# EAGLE schematic sap_flux-v20 (EAGLE 8.0.0)

## Sheet 1 of 3
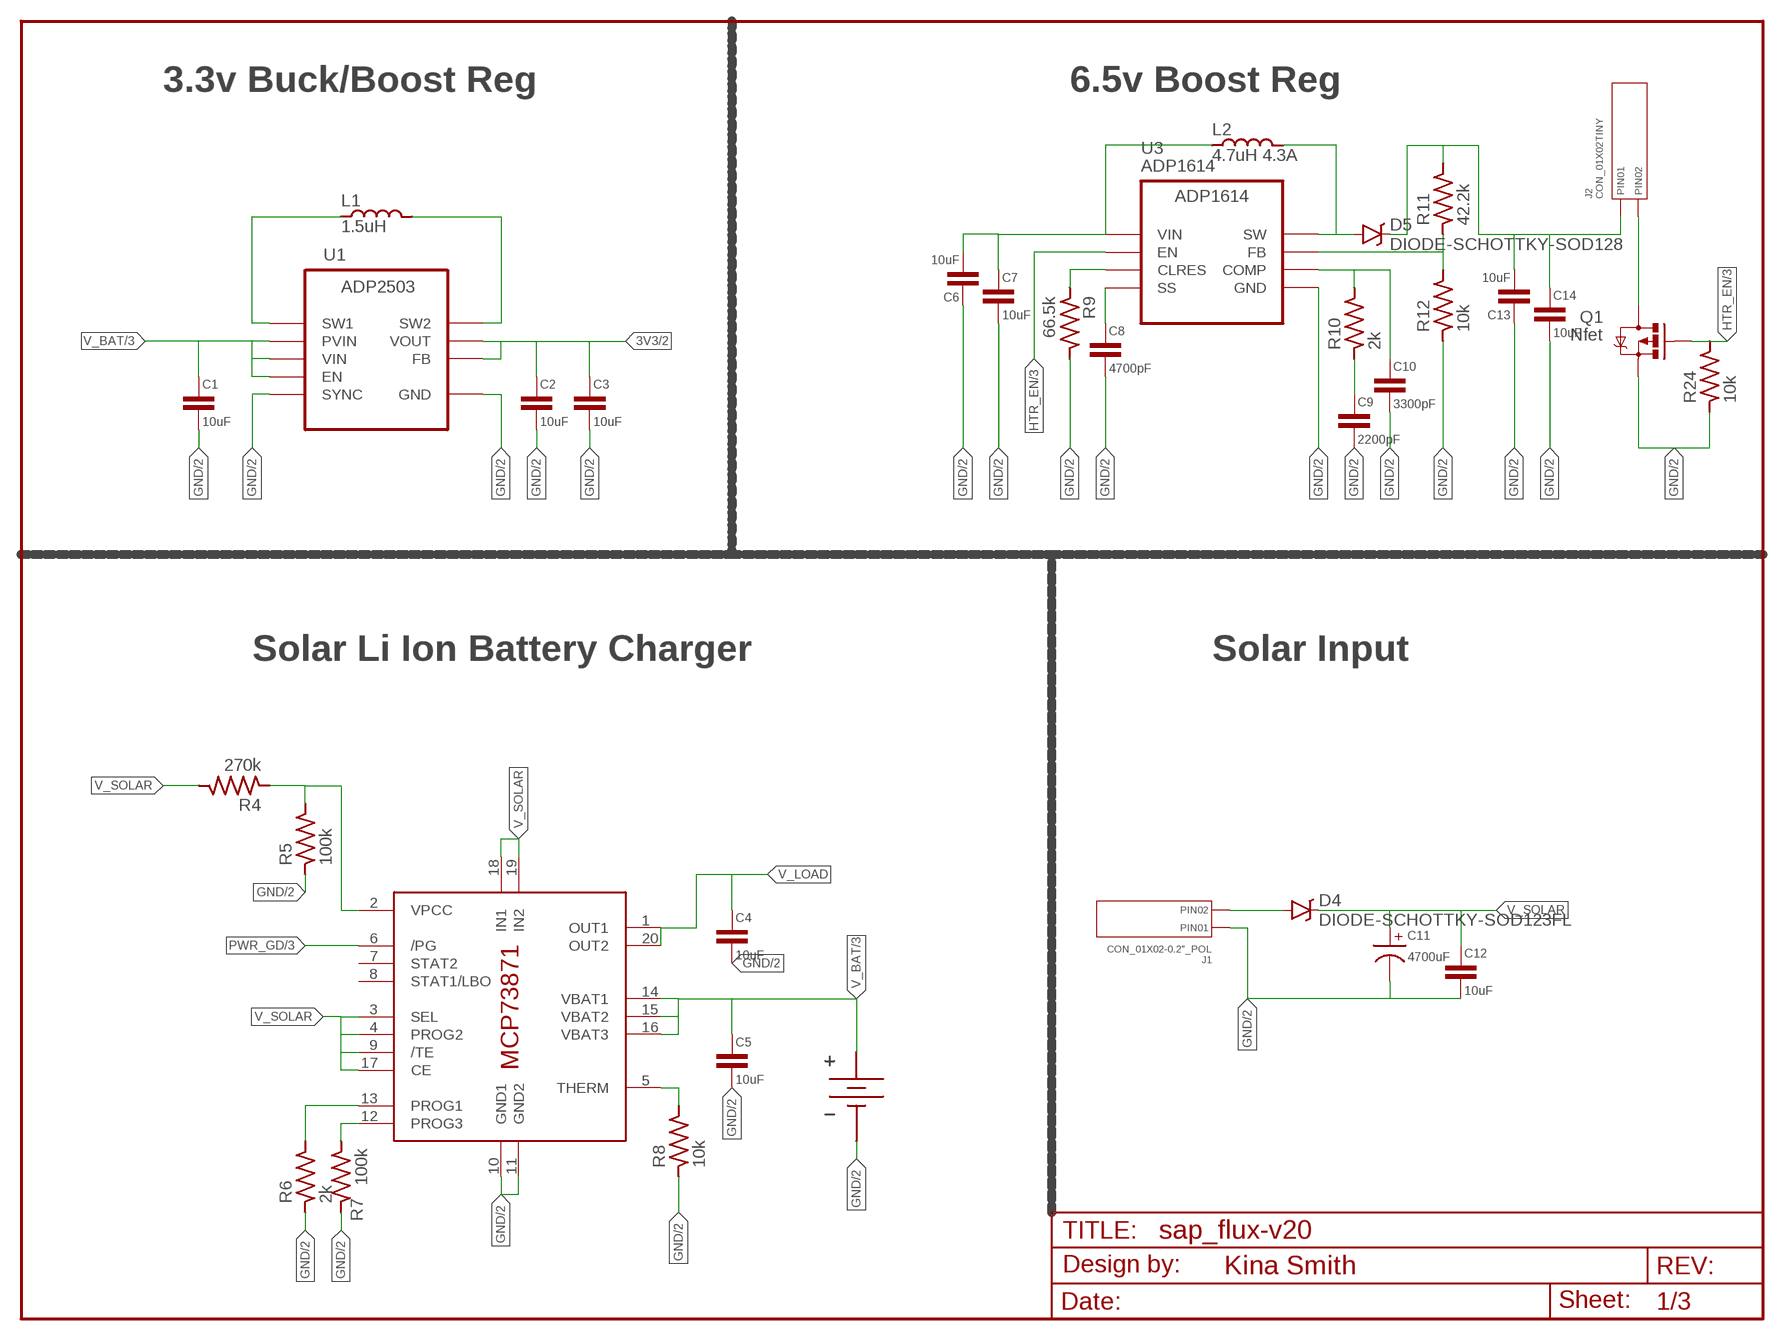
[diagram p0: schematic, sheet 1]

### Parts
BATT1  BATTERY_HOLDER-18650_CLIP  [BAT_18650_CLIP]
C1  10uF  CAPACITOR_NP0805-N  [C0805-N]
C2  10uF  CAPACITOR_NP0805-N  [C0805-N]
C3  10uF  CAPACITOR_NP0805-N  [C0805-N]
C4  10uF  CAPACITOR_NP0805-N  [C0805-N]
C5  10uF  CAPACITOR_NP0805-N  [C0805-N]
C6  10uF  CAPACITOR_NP0805-N  [C0805-N]
C7  10uF  CAPACITOR_NP0805-N  [C0805-N]
C8  4700pF  CAPACITOR_NP0603-N  [C0603-N]
C9  2200pF  CAPACITOR_NP0603-N  [C0603-N]
C10  3300pF  CAPACITOR_NP0603-N  [C0603-N]
C11  4700uF  CAPACITOR_P-TH_5MM  [CP_TH_5MM]
C12  10uF  CAPACITOR_NP0805-N  [C0805-N]
C13  10uF  CAPACITOR_NP0805-N  [C0805-N]
C14  10uF  CAPACITOR_NP0805-N  [C0805-N]
D4  DIODE-SCHOTTKY-SOD123FL  [SOD-123FL]
D5  DIODE-SCHOTTKY-SOD128  [SOD128]
FRAME1  FRAME-LETTER  [CREATIVE_COMMONS]
J1  CON_01X02-0.2"_POL  [1X02_SCREWTERM_0.2IN]
J2  CON_01X02TINY  [1X02_TINY]
L1  1.5uH  INDUCTOR3030  [L3030]
L2  4.7uH 4.3A  INDUCTOR8080  [L8080]
Q1  Nfet  MOSFET-PCHANNELSOT23-3  [SOT23-3]
R4  270k  RESISTOR0603-N  [R0603-N]
R5  100k  RESISTOR0603-N  [R0603-N]
R6  2k  RESISTOR0603-N  [R0603-N]
R7  100k  RESISTOR0603-N  [R0603-N]
R8  10k  RESISTOR0603-N  [R0603-N]
R9  66.5k  RESISTOR0603-N  [R0603-N]
R10  2k  RESISTOR0603-N  [R0603-N]
R11  42.2k  RESISTOR0603-N  [R0603-N]
R12  10k  RESISTOR0603-N  [R0603-N]
R24  10k  RESISTOR0603-N  [R0603-N]
U1  ADP2503  [DFN300X300X80-11N]
U2  MCP73871  [QFN20]
U3  ADP1614  [DFN300X300X80-11N]

### Nets
3V3: C2.1 C3.1 U1.1(VOUT) U1.10(FB) ; also sheet 2,3
6V5: C13.2 C14.1 D5.C-1(C) J2.NEG(PIN1) R11.2
6V5_INDUCTOR: D5.A-2(A) L2.2 U3.6(SW) U3.7(SW)
GND: BATT1.NEG_1(GND) BATT1.NEG_2(GND) BATT1.NEG_3(GND) C1.2 C2.2 C3.2 C4.2 C5.2 C6.1 C7.2 C8.2 C9.2 C10.2 C11.NEG C12.2 C13.1 C14.2 J1.NEG(PIN1) Q1.2(S) R5.1 R6.1 R7.1 R8.1 R9.2 R12.1 R24.1 U1.3(GND) U1.7(SYNC) U1.9(GND) U1.11(GND) U2.10(GND1) U2.11(GND2) U3.4(GND) U3.5(GND) U3.11(GND) ; also sheet 2,3
HTR_EN: Q1.1(G) R24.2 U3.3(EN) ; also sheet 3
N$5: D4.A J1.POS(PIN2)
N$7: R4.1 R5.2 U2.2(VPCC)
N$12: R6.2 U2.13(PROG1)
N$13: R7.2 U2.12(PROG3)
N$17: L1.P$1 U1.4(SW1)
N$18: L1.P$2 U1.2(SW2)
N$19: R8.2 U2.5(THERM)
N$20: J2.POS(PIN2) Q1.3(D)
N$21: C8.1 U3.10(SS)
N$22: R9.1 U3.9(CLRES)
N$26: R11.1 R12.2 U3.2(FB)
N$28: C10.1 R10.2 U3.1(COMP)
N$29: C9.1 R10.1
PWR_GD: U2.6(/PG) ; also sheet 3
V_BAT: BATT1.POS_1(VBAT) BATT1.POS_2(VBAT) BATT1.POS_3(VBAT) C1.1 C5.1 C6.2 C7.1 L2.1 U1.5(PVIN) U1.6(EN) U1.8(VIN) U2.14(VBAT1) U2.15(VBAT2) U2.16(VBAT3) U3.8(VIN) ; also sheet 3
V_LOAD: C4.1 U2.1(OUT1) U2.20(OUT2)
V_SOLAR: C11.POS C12.1 D4.C R4.2 U2.3(SEL) U2.4(PROG2) U2.9(/TE) U2.17(CE) U2.18(IN1) U2.19(IN2)
Unconnected: U2.7(STAT2) U2.8(STAT1/LBO)

### Notes on the sheet
- 3.3v Buck/Boost Reg | 6.5v Boost Reg
- Solar Li Ion Battery Charger | Solar Input

## Sheet 2 of 3
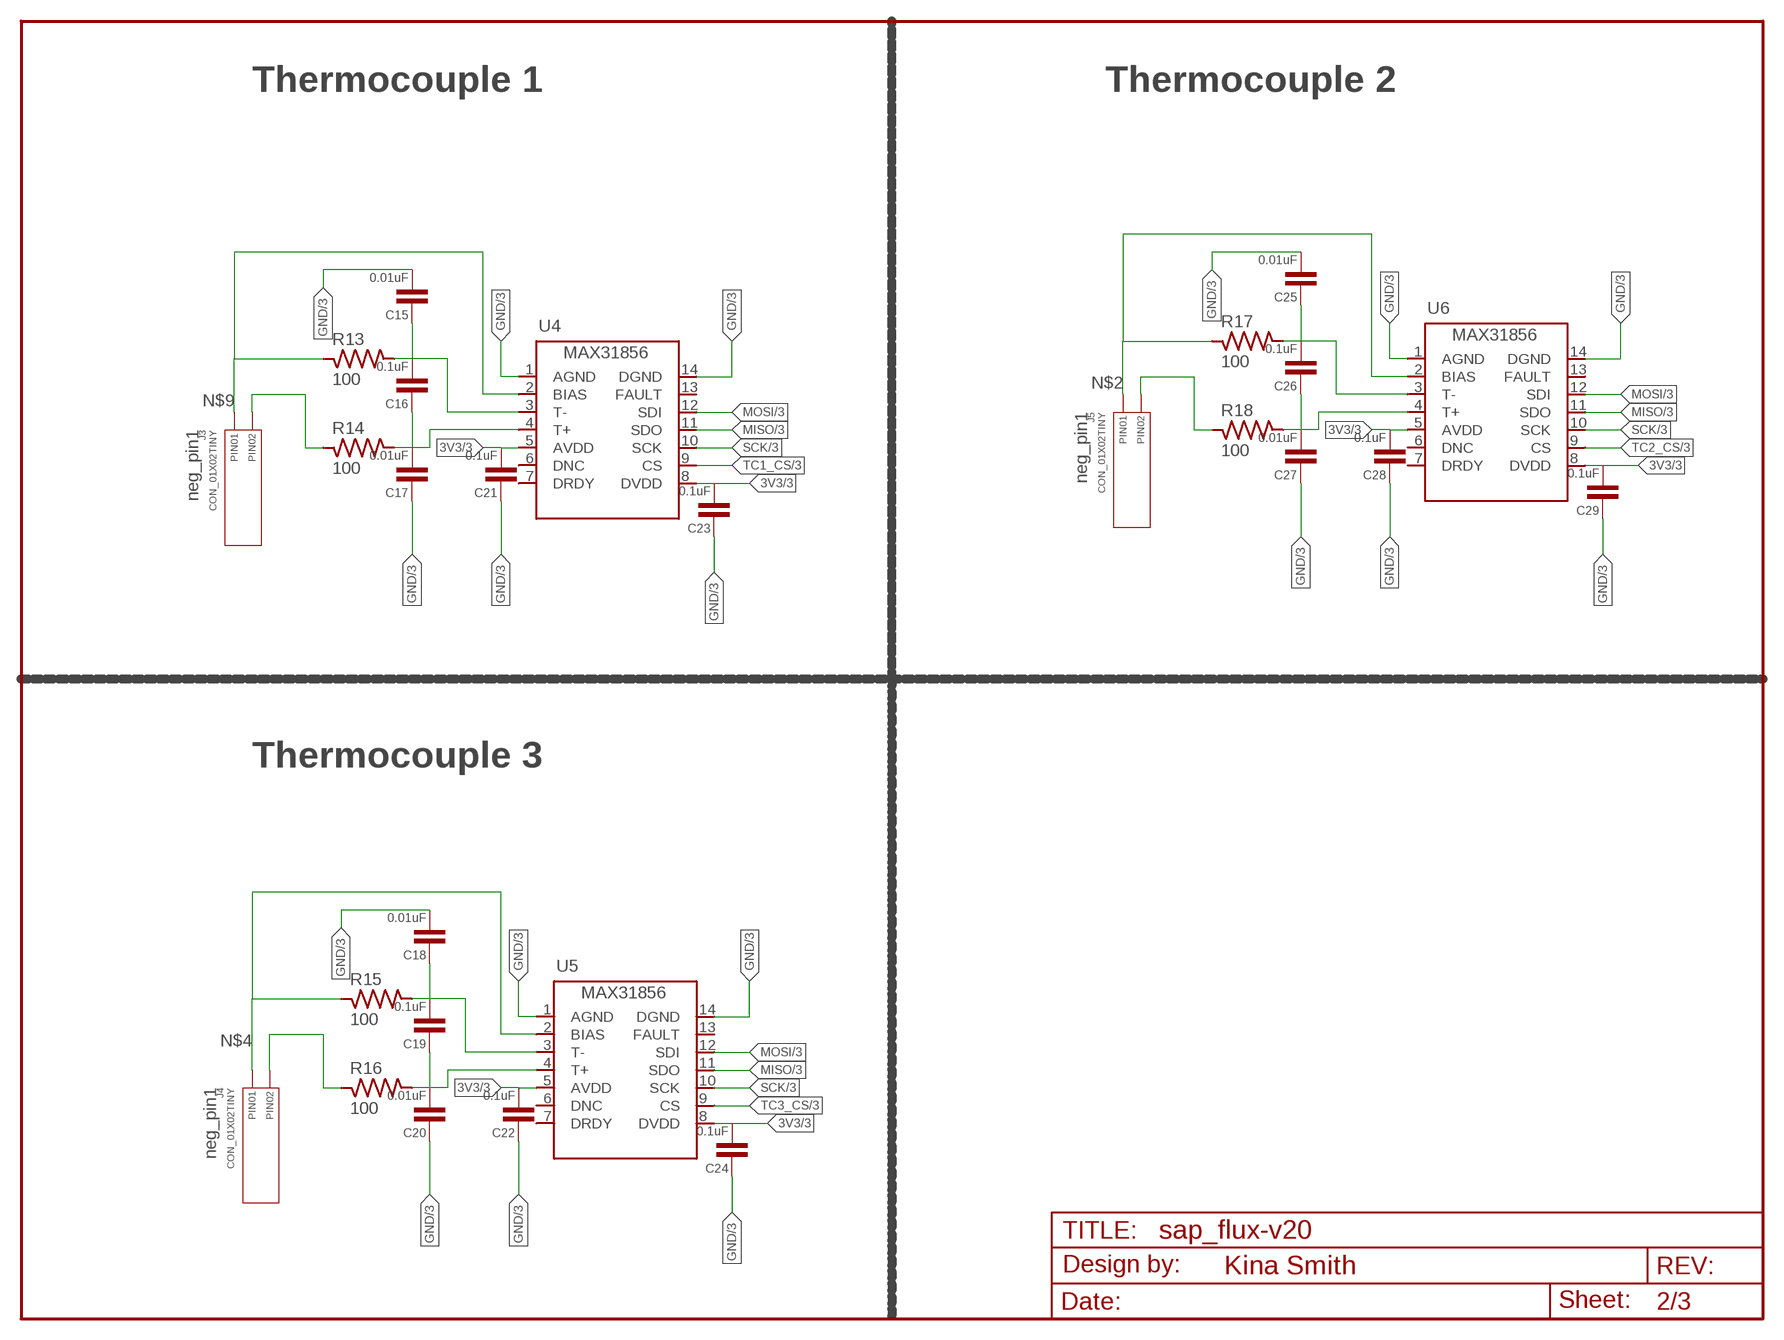
[diagram p1: schematic, sheet 2]

### Parts
C15  0.01uF  CAPACITOR_NP0603-N  [C0603-N]
C16  0.1uF  CAPACITOR_NP0603-N  [C0603-N]
C17  0.01uF  CAPACITOR_NP0603-N  [C0603-N]
C18  0.01uF  CAPACITOR_NP0603-N  [C0603-N]
C19  0.1uF  CAPACITOR_NP0603-N  [C0603-N]
C20  0.01uF  CAPACITOR_NP0603-N  [C0603-N]
C21  0.1uF  CAPACITOR_NP0603-N  [C0603-N]
C22  0.1uF  CAPACITOR_NP0603-N  [C0603-N]
C23  0.1uF  CAPACITOR_NP0603-N  [C0603-N]
C24  0.1uF  CAPACITOR_NP0603-N  [C0603-N]
C25  0.01uF  CAPACITOR_NP0603-N  [C0603-N]
C26  0.1uF  CAPACITOR_NP0603-N  [C0603-N]
C27  0.01uF  CAPACITOR_NP0603-N  [C0603-N]
C28  0.1uF  CAPACITOR_NP0603-N  [C0603-N]
C29  0.1uF  CAPACITOR_NP0603-N  [C0603-N]
FRAME2  FRAME-LETTERNO_PACKAGE  [DUMMY]
J3  CON_01X02TINY  [1X02_TINY]
J4  CON_01X02TINY  [1X02_TINY]
J5  CON_01X02TINY  [1X02_TINY]
R13  100  RESISTOR0603-N  [R0603-N]
R14  100  RESISTOR0603-N  [R0603-N]
R15  100  RESISTOR0603-N  [R0603-N]
R16  100  RESISTOR0603-N  [R0603-N]
R17  100  RESISTOR0603-N  [R0603-N]
R18  100  RESISTOR0603-N  [R0603-N]
U4  MAX31856MUD+  [TSSOP14]
U5  MAX31856MUD+  [TSSOP14]
U6  MAX31856MUD+  [TSSOP14]

### Nets
3V3: C21.2 C22.2 C23.2 C24.2 C28.2 C29.2 U4.5(AVDD) U4.8(DVDD) U5.5(AVDD) U5.8(DVDD) U6.5(AVDD) U6.8(DVDD) ; also sheet 1,3
GND: C15.2 C17.1 C18.2 C20.1 C21.1 C22.1 C23.1 C24.1 C25.2 C27.1 C28.1 C29.1 U4.1(AGND) U4.14(DGND) U5.1(AGND) U5.14(DGND) U6.1(AGND) U6.14(DGND) ; also sheet 1,3
MISO: U4.11(SDO) U5.11(SDO) U6.11(SDO) ; also sheet 3
MOSI: U4.12(SDI) U5.12(SDI) U6.12(SDI) ; also sheet 3
N$1: J5.POS(PIN2) R18.1
N$2: J5.NEG(PIN1) R17.1 U6.2(BIAS)
N$3: J4.POS(PIN2) R16.1
N$4: J4.NEG(PIN1) R15.1 U5.2(BIAS)
N$8: J3.POS(PIN2) R14.1
N$9: J3.NEG(PIN1) R13.1 U4.2(BIAS)
N$31: C19.1 C20.2 R16.2 U5.4(T+)
N$32: C18.1 C19.2 R15.2 U5.3(T-)
N$38: C16.1 C17.2 R14.2 U4.4(T+)
N$39: C15.1 C16.2 R13.2 U4.3(T-)
N$40: C25.1 C26.2 R17.2 U6.3(T-)
N$41: C26.1 C27.2 R18.2 U6.4(T+)
SCK: U4.10(SCK) U5.10(SCK) U6.10(SCK) ; also sheet 3
TC1_CS: U4.9(CS) ; also sheet 3
TC2_CS: U6.9(CS) ; also sheet 3
TC3_CS: U5.9(CS) ; also sheet 3
Unconnected: U4.6(DNC) U4.7(DRDY) U4.13(FAULT) U5.6(DNC) U5.7(DRDY) U5.13(FAULT) U6.6(DNC) U6.7(DRDY) U6.13(FAULT)

### Notes on the sheet
- Thermocouple 1 | Thermocouple 2
- Thermocouple 3

## Sheet 3 of 3
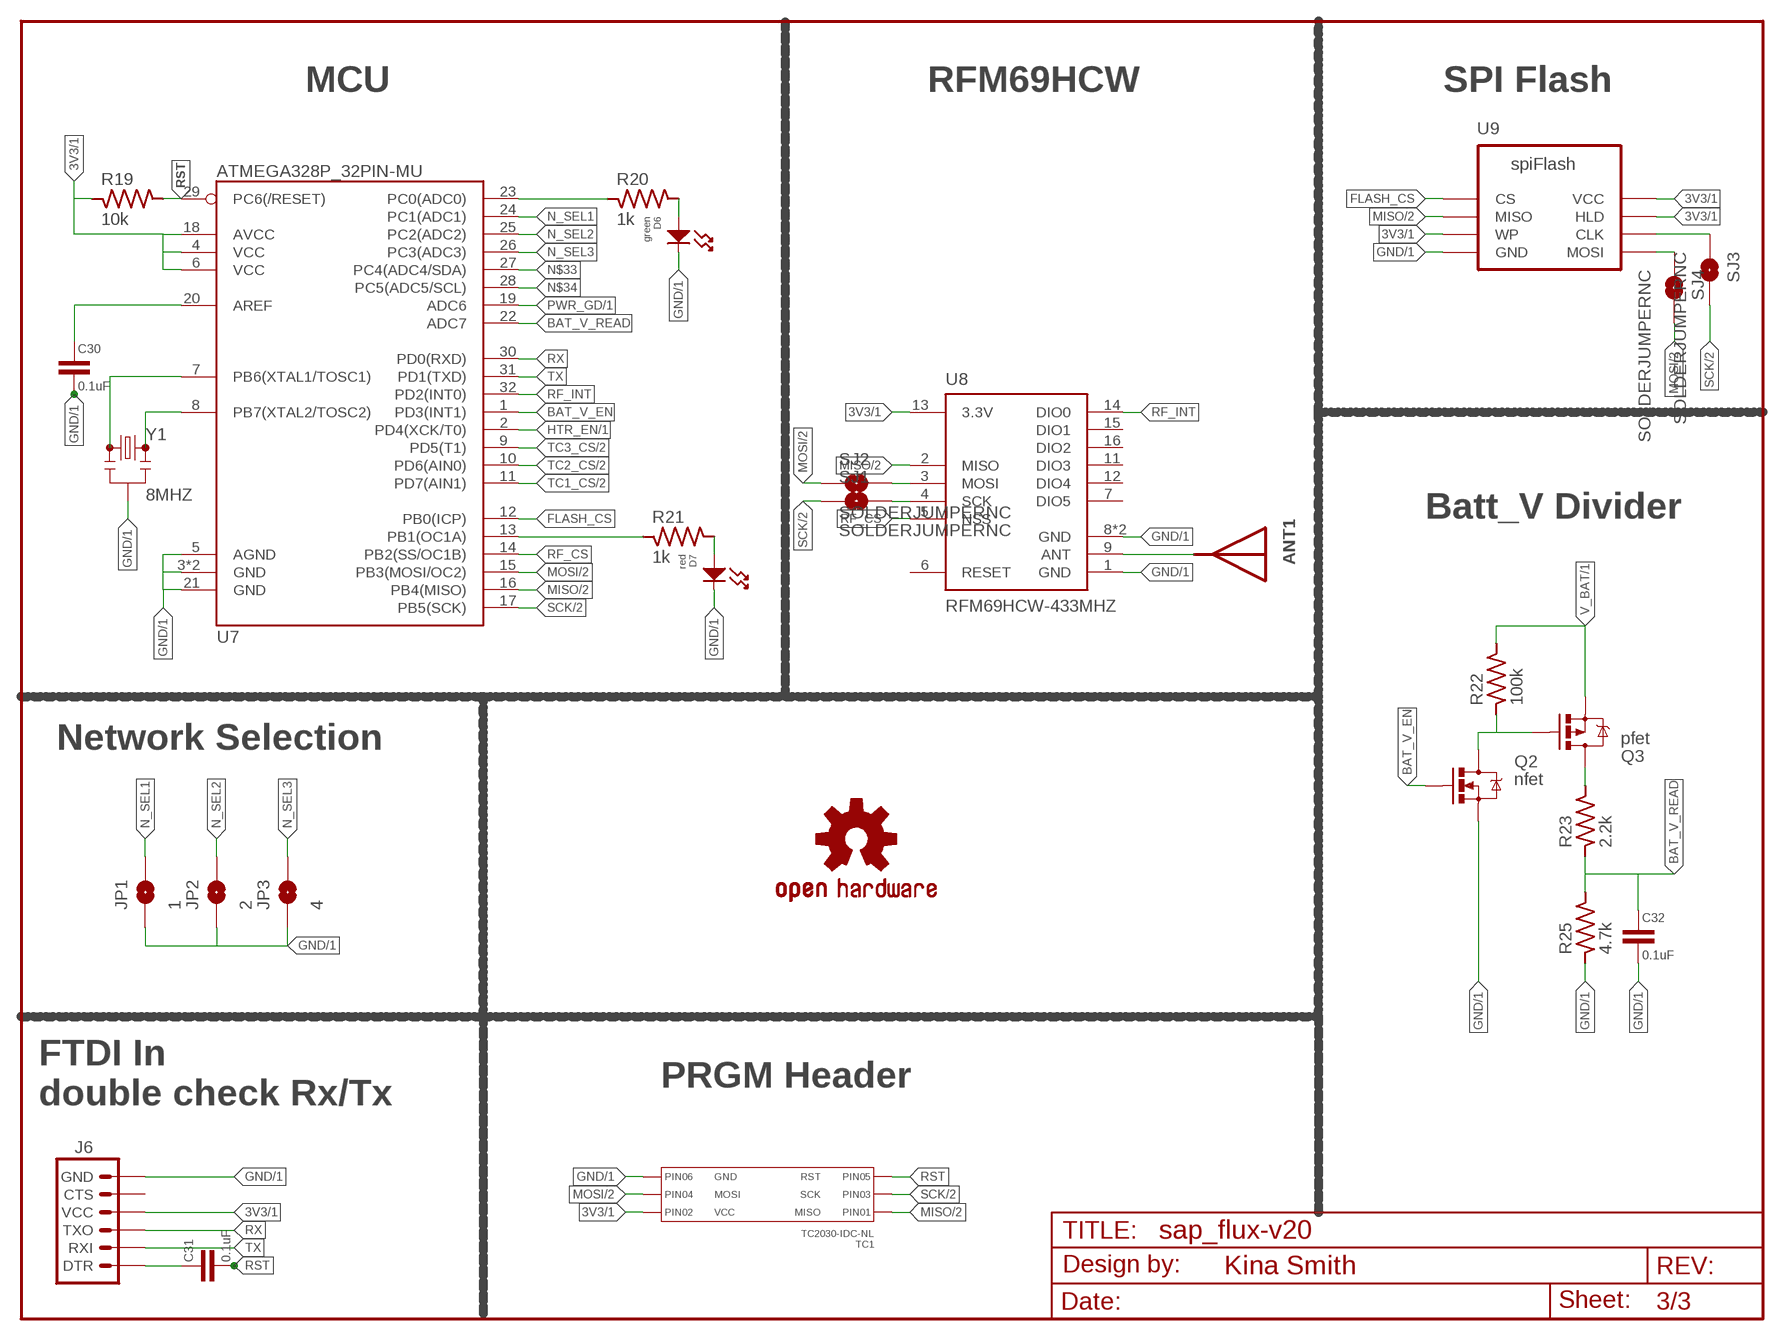
[diagram p2: schematic, sheet 3]

### Parts
ANT1  ANTENNA-433_CHIP  [ANT_433_CHIP]
C30  0.1uF  CAPACITOR_NP0603-N  [C0603-N]
C31  0.1uF  CAPACITOR_NP0603-N  [C0603-N]
C32  0.1uF  CAPACITOR_NP0603-N  [C0603-N]
D6  green  LED_SINGLE-0603  [LED0603]
D7  red  LED_SINGLE-0603  [LED0603]
FRAME3  FRAME-LETTERNO_PACKAGE  [DUMMY]
J6  ARDUINO_SERIAL_PROGRAMPTH  [1X06]
JP1  1  JUMPER-PAD-2-NOYES_SILK  [PAD-JUMPER-2-NO_YES_SILK]
JP2  2  JUMPER-PAD-2-NOYES_SILK  [PAD-JUMPER-2-NO_YES_SILK]
JP3  4  JUMPER-PAD-2-NOYES_SILK  [PAD-JUMPER-2-NO_YES_SILK]
LOGO1  OSHW-LOGOS-COPPER  [OSHW-LOGO-S_COPPER]
Q2  nfet  MOSFET-NCHANNELSOT23-3  [SOT23-3]
Q3  pfet  MOSFET-PCHANNELSOT23-3  [SOT23-3]
R19  10k  RESISTOR0603-N  [R0603-N]
R20  1k  RESISTOR0603-N  [R0603-N]
R21  1k  RESISTOR0603-N  [R0603-N]
R22  100k  RESISTOR0603-N  [R0603-N]
R23  2.2k  RESISTOR0603-N  [R0603-N]
R25  4.7k  RESISTOR0603-N  [R0603-N]
SJ1  SOLDERJUMPERNC  [SJ_2S]
SJ2  SOLDERJUMPERNC  [SJ_2S]
SJ3  SOLDERJUMPERNC  [SJ_2S]
SJ4  SOLDERJUMPERNC  [SJ_2S]
TC1  TC2030-IDC-NL  CON_02X03_AVRISP_TC2030-IDC-NL  [TC2030-IDC-NL]
U7  ATMEGA328P_32PIN-MU  [MLF32_RECTPADS]
U8  RFM69HCW-433MHZ  [RFM69HCW-XXXS2]
U9  WINBOND_FLASH_4MBIT-SOIC  [SOIC8]
Y1  8MHZ  RESONATOR8MHZ  [RESONATOR-SMD]

### Nets
3V3: J6.4(VCC) R19.1 TC1.P$2(PIN2) U7.4(VCC) U7.6(VCC) U7.18(AVCC) U8.13(3.3V) U9.3(WP) U9.7(HLD) U9.8(VCC) ; also sheet 1,2
BAT_V_EN: Q2.1(G) U7.1(PD3(INT1))
BAT_V_READ: C32.1 R23.1 R25.2 U7.22(ADC7)
FLASH_CS: U7.12(PB0(ICP)) U9.1(CS)
GND: C30.2 C32.2 D6.CATHODE D7.CATHODE J6.6(GND) JP1.1 JP2.1 JP3.1 Q2.2(S) R25.1 TC1.P$6(PIN6) U7.3(GND) U7.5(AGND) U7.21(GND) U7.PAD(GND) U8.1(GND) U8.8(GND) U8.10(GND) U9.4(GND) Y1.2 ; also sheet 1,2
HTR_EN: U7.2(PD4(XCK/T0)) ; also sheet 1
MISO: TC1.P$1(PIN1) U7.16(PB4(MISO)) U8.2(MISO) U9.2(MISO) ; also sheet 2
MOSI: SJ2.1 SJ4.2 TC1.P$4(PIN4) U7.15(PB3(MOSI/OC2)) ; also sheet 2
N$6: SJ3.1 U9.6(CLK)
N$10: SJ4.1 U9.5(MOSI)
N$15: SJ2.2 U8.3(MOSI)
N$16: SJ1.2 U8.4(SCK)
N$23: ANT1.1 U8.9(ANT)
N$24: Q3.3(D) R23.2
N$25: Q2.3(D) Q3.1(G) R22.1
N$27: R20.1 U7.23(PC0(ADC0))
N$30: C31.1 J6.1(DTR)
N$33: U7.27(PC4(ADC4/SDA))
N$34: U7.28(PC5(ADC5/SCL))
N$36: D7.ANODE R21.2
N$37: D6.ANODE R20.2
N$52: U7.8(PB7(XTAL2/TOSC2)) Y1.3
N$53: U7.7(PB6(XTAL1/TOSC1)) Y1.1
N$54: C30.1 U7.20(AREF)
N_SEL1: JP1.2 U7.24(PC1(ADC1))
N_SEL2: JP2.2 U7.25(PC2(ADC2))
N_SEL3: JP3.2 U7.26(PC3(ADC3))
PIN_9: R21.1 U7.13(PB1(OC1A))
PWR_GD: U7.19(ADC6) ; also sheet 1
RF_CS: U7.14(PB2(SS/OC1B)) U8.5(NSS)
RF_INT: U7.32(PD2(INT0)) U8.14(DIO0)
RST: C31.2 R19.2 TC1.P$5(PIN5) U7.29(PC6(/RESET))
RX: J6.3(TXO) U7.30(PD0(RXD))
SCK: SJ1.1 SJ3.2 TC1.P$3(PIN3) U7.17(PB5(SCK)) ; also sheet 2
TC1_CS: U7.11(PD7(AIN1)) ; also sheet 2
TC2_CS: U7.10(PD6(AIN0)) ; also sheet 2
TC3_CS: U7.9(PD5(T1)) ; also sheet 2
TX: J6.2(RXI) U7.31(PD1(TXD))
V_BAT: Q3.2(S) R22.2 ; also sheet 1
Unconnected: J6.5(CTS) U8.6(RESET) U8.7(DIO5) U8.11(DIO3) U8.12(DIO4) U8.15(DIO1) U8.16(DIO2)

### Notes on the sheet
- MCU | RFM69HCW | SPI Flash
- Batt_V Divider
- Network Selection
- PRGM Header
- FTDI In 
  double check Rx/Tx

## Library data of the parts
ANT1 = My_RF:ANTENNA; PARTNO: 0433AT62A0020E
BATT1 = My_Connectors:BATTERY_HOLDER; NOTE: Parts x2!!; PARTNO: 54
C1-C7 C12-C14 = My_Passives:CAPACITOR_NP; PARTNO: GRM21BR61C106KE15K
C8 = My_Passives:CAPACITOR_NP; PARTNO: GRM188R71C472KA01D
C9 = My_Passives:CAPACITOR_NP; PARTNO: GRM188R71C222KA01D
C10 = My_Passives:CAPACITOR_NP; PARTNO: C0603C332K4RACTU
C11 = My_Passives:CAPACITOR_P: Library: MF_Passives Description: Device for Polarized Capacitors. Manufacture part number (MPN), Voltage Rating, and Tolerance can be added via Attributes. Check https://factory.macrofab.com/parts for the house parts list.; PARTNO: ECA-1AM472
C15 C17 C18 C20 C25 C27 = My_Passives:CAPACITOR_NP; PARTNO: GRM188R71C103KA01D
C16 C19 C21-C24 C26 C28-C32 = My_Passives:CAPACITOR_NP; PARTNO: CC0603KRX7R7BB104
D4 = My_Descrete_Semiconductors:DIODE-SCHOTTKY: Schottky diodes in SFE's production catalog BAT20J 1A 23V 0.62Vf RB751 120mA 40V 0.37Vf PMEG4005EJ 0.5A 40V 0.42Vf MBRA140 1A 40V 0.5Vf B340A 3A 40V SMA; PARTNO: MBR120VLSFT1G
D5 = My_Descrete_Semiconductors:DIODE-SCHOTTKY: Schottky diodes in SFE's production catalog BAT20J 1A 23V 0.62Vf RB751 120mA 40V 0.37Vf PMEG4005EJ 0.5A 40V 0.42Vf MBRA140 1A 40V 0.5Vf B340A 3A 40V SMA; PARTNO: CMS05(TE12L,Q,M)
D6 = My_LEDs:LED_SINGLE: Library: MF_LEDs Description: Device for Single LED Packages. Manufacture part number (MFG#) can be added via Attributes.; HOUSEPART: NO; PARTNO: LTST-C191KGKT; POPULATE: 1
D7 = My_LEDs:LED_SINGLE: Library: MF_LEDs Description: Device for Single LED Packages. Manufacture part number (MFG#) can be added via Attributes.; HOUSEPART: NO; PARTNO: LTST-C191KRKT; POPULATE: 1
FRAME1 = My_Aesthetics:FRAME-LETTER: Schematic Frame Standard 8.5x11 US Letter frame; PARTNO: NA
FRAME2 FRAME3 = My_Aesthetics:FRAME-LETTER: Schematic Frame Standard 8.5x11 US Letter frame; DESIGNER: Nobody; PARTNO: NA; VERSION: v01
J1 = My_Connectors:CON_01X02: Library: MF_Connectors Description: Header Connector with 02 Positions and 01 Rows. Use the LABEL Attribute to label the pin on the schematic and PCB. You can remove the attributes on the PCB by using the SMASH function on the part and then deleting the text.; PARTNO: 0398890042
J2-J5 = My_Connectors:CON_01X02: Library: MF_Connectors Description: Header Connector with 02 Positions and 01 Rows. Use the LABEL Attribute to label the pin on the schematic and PCB. You can remove the attributes on the PCB by using the SMASH function on the part and then deleting the text.; NOTE: neg_pin1
J6 = My_Connectors:ARDUINO_SERIAL_PROGRAM: FTDI connector footprints; PARTNO: 68001-106HLF
JP1-JP3 = My_Passives:JUMPER-PAD-2-NO; PARTNO: NA
L1 = My_Passives:INDUCTOR; PARTNO: NR3015T1R5N
L2 = My_Passives:INDUCTOR; PARTNO: NRS8040T100MJGJ
LOGO1 = My_Aesthetics:OSHW-LOGO: Open Source Hardware Logo This logo indicates the piece of hardware it is found on incorporates a OSHW license and/or adheres to the definition of open source hardware found here: http://freedomdefined.org/OSHW
Q1 = My_Descrete_Semiconductors:MOSFET-PCHANNEL: Generic PMOSFET IRLML2244 - TRANS-11153 (SOT-23 -20V -4.3A) (1.Gate 2.Source 3.Drain) FQP27P06 - COM-10349 <http://www.sparkfun.com/products/10349> (TO-220 -60V -27A) (1.Gate 2.Source 3.Drain); PARTNO: DMN2075U-7
Q2 = My_Descrete_Semiconductors:MOSFET-NCHANNEL: Common NMOSFET Parts MFG P/N Store ID Prod ID FDD8780 TRANS-09984 SI7820DN TRANS-11055 FDS6630A IC-08089 2N7002PW TRANS-11151 FQP30N06L COM-10213 TRANS-10060 BSS123LT1G TRANS-08345 BSS138 TRANS-00830 BS170 2N7000; PARTNO: BSS138
Q3 = My_Descrete_Semiconductors:MOSFET-PCHANNEL: Generic PMOSFET IRLML2244 - TRANS-11153 (SOT-23 -20V -4.3A) (1.Gate 2.Source 3.Drain) FQP27P06 - COM-10349 <http://www.sparkfun.com/products/10349> (TO-220 -60V -27A) (1.Gate 2.Source 3.Drain); PARTNO: IRLML2244TRPBF
R4 = My_Passives:RESISTOR; PARTNO: RC0603FR-07270KL
R5 R7 R22 = My_Passives:RESISTOR; PARTNO: RC0603FR-07100KL
R6 R10 = My_Passives:RESISTOR; PARTNO: RC0603FR-072KL
R8 R12 R19 R24 = My_Passives:RESISTOR; PARTNO: RC0603FR-0710KL
R9 = My_Passives:RESISTOR; PARTNO: RC0603FR-0766K5L
R11 = My_Passives:RESISTOR; PARTNO: RC0603FR-0742K2L
R13-R18 = My_Passives:RESISTOR; PARTNO: RC0603FR-07100RL
R20 R21 = My_Passives:RESISTOR; PARTNO: RC0603FR-071KL
R23 = My_Passives:RESISTOR; PARTNO: RC0603FR-072K2L
R25 = My_Passives:RESISTOR; PARTNO: RC0603FR-074K7L
SJ1-SJ4 = My_Connectors:SOLDERJUMPER: Solder Jumper Standard SMD solder jumper. Used to automate production. Two varients : Normally Open and Normally Closed are the same, but have different paste layers. NC will have a large amount of paste and should jumper during reflow.; PARTNO: NA
TC1 = My_Connectors:CON_02X03: Library: MF_Connectors Description: Header Connector with 6 Positions and 02 Rows. Use the LABEL Attribute to label the pin on the schematic and PCB. You can remove the attributes on the PCB by using the SMASH function on the part and then deleting the text.; HOUSEPART: NO; LABEL01: MISO; LABEL02: VCC; LABEL03: SCK; LABEL04: MOSI; LABEL05: RST; LABEL06: GND; MPN: TC2030-IDC-NL; PARTNO: NA; POPULATE: 0; URL: http://www.tag-connect.com/AVRISP
U1 = My_IC_Power:ADP2503; PARTNO: ADP2503ACPZ-3.3-R7
U2 = My_IC_Power:MCP73871; PARTNO: MCP73871-2AAI/ML-ND
U3 = My_IC_Power:ADP1614: ADP1614ACPZ-R7 THIS IS THE ADJUSTABLE FREQ Version! CLRES HIGH/LOW to select Frequency! ---CHECK TO SEE IF THIS MATTERS!!; PARTNO: ADP1614ACPZ-650-R7
U4-U6 = My_IC_Digital:MAX31856MUD+; PARTNO: MAX31856MUD+
U7 = My_IC_Digital:ATMEGA328P_32PIN: Atmel 32-pin 8-bit micro 16k flash.; PARTNO: ATMEGA328P-MU
U8 = My_RF:RFM69H; PARTNO: COM-13910; PROD_ID: IC-11997, IC-12053
U9 = My_IC_Digital:WINBOND_FLASH_4MBIT; PARTNO: W25X40CLSNIG
Y1 = My_xTal:RESONATOR: Resonator Small SMD resonator. Used, eg, on the Arduino Pro/ Pro Mini boards. 8MHz- XTAL-08895 16MHz- XTAL-08900; PARTNO: CSTCE8M00G55-R0; PROD_ID: XTAL-08895